# EAGLE design EvalBoard_MUXandTouchController_v0.2a (EAGLE 9.4.1)
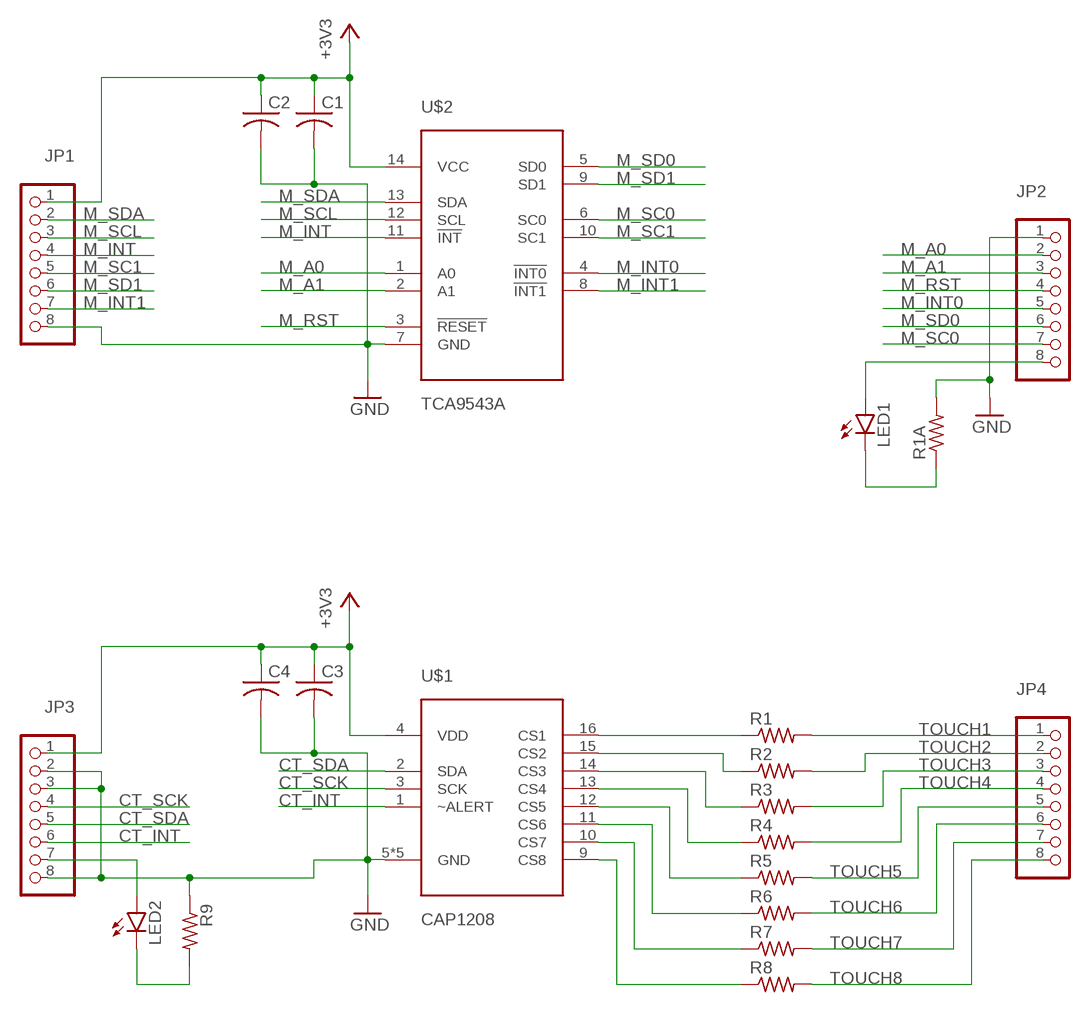
[diagram p0: schematic, sheet 1]

## Parts
C1  C-USC0603  [C0603]
C2  C-USC0603  [C0603]
C3  C-USC0603  [C0603]
C4  C-USC0603  [C0603]
JP1  PINHD-1X8BIG  [1X08-BIG]
JP2  PINHD-1X8BIG  [1X08-BIG]
JP3  PINHD-1X8BIG  [1X08-BIG]
JP4  PINHD-1X8BIG  [1X08-BIG]
LED1  LEDCHIP-LED0603  [CHIP-LED0603]
LED2  LEDCHIP-LED0603  [CHIP-LED0603]
R1  R-US_R0603  [R0603]
R1A  R-US_R0603  [R0603]
R2  R-US_R0603  [R0603]
R3  R-US_R0603  [R0603]
R4  R-US_R0603  [R0603]
R5  R-US_R0603  [R0603]
R6  R-US_R0603  [R0603]
R7  R-US_R0603  [R0603]
R8  R-US_R0603  [R0603]
R9  R-US_R0603  [R0603]
U$1  CAP1208  [QFN-16-3X3]
U$2  TCA9543A  [TSSOP-14]

## Nets
+3V3: C1.1 C2.1 C3.1 C4.1 JP1.1 JP3.1 U$1.4(VDD) U$2.14(VCC)
CT_INT: JP3.6 U$1.1(~ALERT)
CT_SCK: JP3.4 U$1.3(SCK)
CT_SDA: JP3.5 U$1.2(SDA)
GND: C1.2 C2.2 C3.2 C4.2 JP1.8 JP2.1 JP3.2 JP3.3 JP3.8 R1A.2 R9.1 U$1.5(GND) U$1.6(GND) U$1.7(GND) U$1.8(GND) U$1.PAD(GND) U$2.7(GND)
M_A0: JP2.2 U$2.1(A0)
M_A1: JP2.3 U$2.2(A1)
M_INT: JP1.4 U$2.11(!INT)
M_INT0: JP2.5 U$2.4(!INT0)
M_INT1: JP1.7 U$2.8(!INT1)
M_RST: JP2.4 U$2.3(!RESET)
M_SC0: JP2.7 U$2.6(SC0)
M_SC1: JP1.5 U$2.10(SC1)
M_SCL: JP1.3 U$2.12(SCL)
M_SD0: JP2.6 U$2.5(SD0)
M_SD1: JP1.6 U$2.9(SD1)
M_SDA: JP1.2 U$2.13(SDA)
N$1: R1.1 U$1.16(CS1)
N$2: JP3.7 LED2.A
N$3: R2.1 U$1.15(CS2)
N$4: LED2.C R9.2
N$5: JP2.8 LED1.A
N$6: LED1.C R1A.1
N$18: R3.1 U$1.14(CS3)
N$19: R4.1 U$1.13(CS4)
N$20: R5.1 U$1.12(CS5)
N$21: R6.1 U$1.11(CS6)
N$22: R7.1 U$1.10(CS7)
N$23: R8.1 U$1.9(CS8)
TOUCH1: JP4.1 R1.2
TOUCH2: JP4.2 R2.2
TOUCH3: JP4.3 R3.2
TOUCH4: JP4.4 R4.2
TOUCH5: JP4.5 R5.2
TOUCH6: JP4.6 R6.2
TOUCH7: JP4.7 R7.2
TOUCH8: JP4.8 R8.2

## Library data of the parts
C1-C4 = resistor:C-US: CAPACITOR, American symbol
JP1-JP4 = adafruit:PINHD-1X8: PIN HEADER
LED1 LED2 = led:LED: LED OSRAM: - CHIPLED LG R971, LG N971, LY N971, LG Q971, LY Q971, LO R971, LY R971 LH N974, LH R974 LS Q976, LO Q976, LY Q976 LO Q996 - Hyper CHIPLED LW Q18S LB Q993, LB Q99A, LB R99A - SideLED LS A670, LO A670, LY A670, LG A670, LP A670 LB A673, LV A673, LT A673, LW A673 LH A674 LY A675 LS A676, LA A676, LO A676, LY A676, LW A676 LS A679, LY A679, LG A679 - Hyper Micro SIDELED® LS Y876, LA Y876, LO Y876, LY Y876 LT Y87S - SmartLED LW L88C, LW L88S LB L89C, LB L89S, LG L890 LS L89K, LO L89K, LY L89K LS L896, LA L896, LO L896, LY L896 - TOPLED LS T670, LO T670, LY T670, LG T670, LP T670 LSG T670, LSP T670, LSY T670, LOP T670, LYG T670 LG T671, LOG T671, LSG T671 LB T673, LV T673, LT T673, LW T673 LH T674 LS T676, LA T676, LO T676, LY T676, LB T676, LH T676, LSB T676, LW T676 LB T67C, LV T67C, LT T67C, LS T67K, LO T67K, LY T67K, LW E67C LS E67B, LA E67B, LO E67B, LY E67B, LB E67C, LV E67C, LT E67C LW T67C LS T679, LY T679, LG T679 LS T770, LO T770, LY T770, LG T770, LP T770 LB T773, LV T773, LT T773, LW T773 LH T774 LS E675, LA E675, LY E675, LS T675 LS T776, LA T776, LO T776, LY T776, LB T776 LHGB T686 LT T68C, LB T68C - Hyper Mini TOPLED® LB M676 - Mini TOPLED Santana® LG M470 LS M47K, LO M47K, LY M47K Source: http://www.osram.convergy.de LUXEON: - LUMILED® LXK2-PW12-R00, LXK2-PW12-S00, LXK2-PW14-U00, LXK2-PW14-V00 LXK2-PM12-R00, LXK2-PM12-S00, LXK2-PM14-U00 LXK2-PE12-Q00, LXK2-PE12-R00, LXK2-PE12-S00, LXK2-PE14-T00, LXK2-PE14-U00 LXK2-PB12-K00, LXK2-PB12-L00, LXK2-PB12-M00, LXK2-PB14-N00, LXK2-PB14-P00, LXK2-PB14-Q00 LXK2-PR12-L00, LXK2-PR12-M00, LXK2-PR14-Q00, LXK2-PR14-R00 LXK2-PD12-Q00, LXK2-PD12-R00, LXK2-PD12-S00 LXK2-PH12-R00, LXK2-PH12-S00 LXK2-PL12-P00, LXK2-PL12-Q00, LXK2-PL12-R00 Source: www.luxeon.com KINGBRIGHT: KA-3528ASYC Source: www.kingbright.com
R1 R1A R2-R9 = resistor:R-US_: RESISTOR, American symbol
U$1 = MonthCalendar:CAP1208: Microchip - 8-Channel Capacitive Touch Sensor Controller - The CAP1208 is a multiple channel capacitive touch sensor controller. It contains eight (8) individual capacitive touch sensor inputs with programmable sensitivity for use in touch sensor applications. Each sensor input is calibrated to compensate for system parasitic capacitance and automatically recalibrated to compensate for gradual environmental changes. The CAP1208 includes Multiple Pattern Touch recognition that allows the user to select a specific set of buttons to be touched simultaneously. If this pattern is detected, a status bit is set and an interrupt is generated. The CAP1208 has Active and Standby states, each with its own sensor input configuration controls. Power consumption in the Standby state is dependent on the number of sensor inputs enabled as well as averaging, sampling time, and cycle time. Deep Sleep is the lowest power state available, drawing 5μA (typical) of current. In this state, no sensor inputs are active, and communications will wake the device.
U$2 = MonthCalendar:TCA9543A: TCA9543A Low Voltage 2-Channel I2C Bus Switch With Interrupt Logic And Reset

## Board
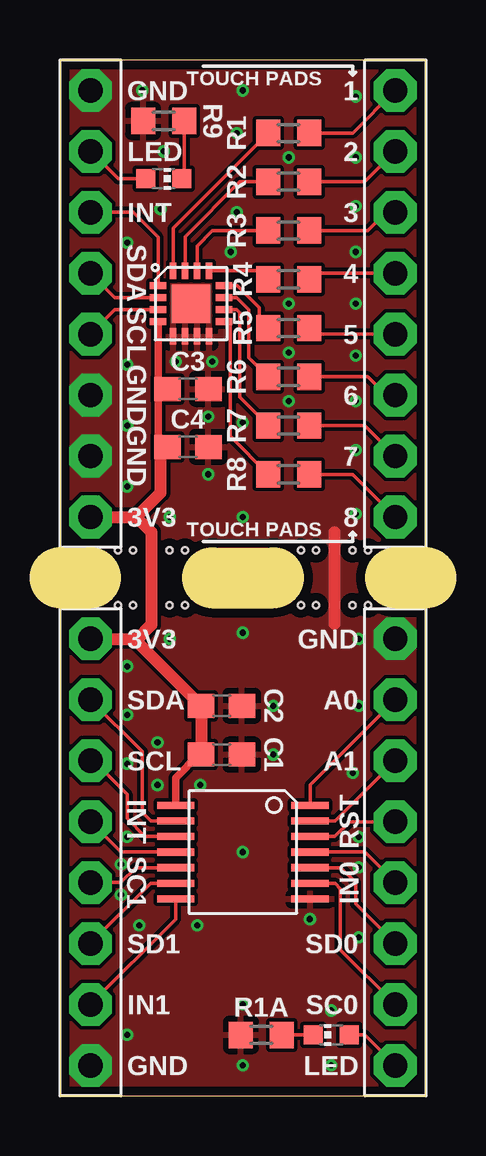
[diagram p1: board, top side]
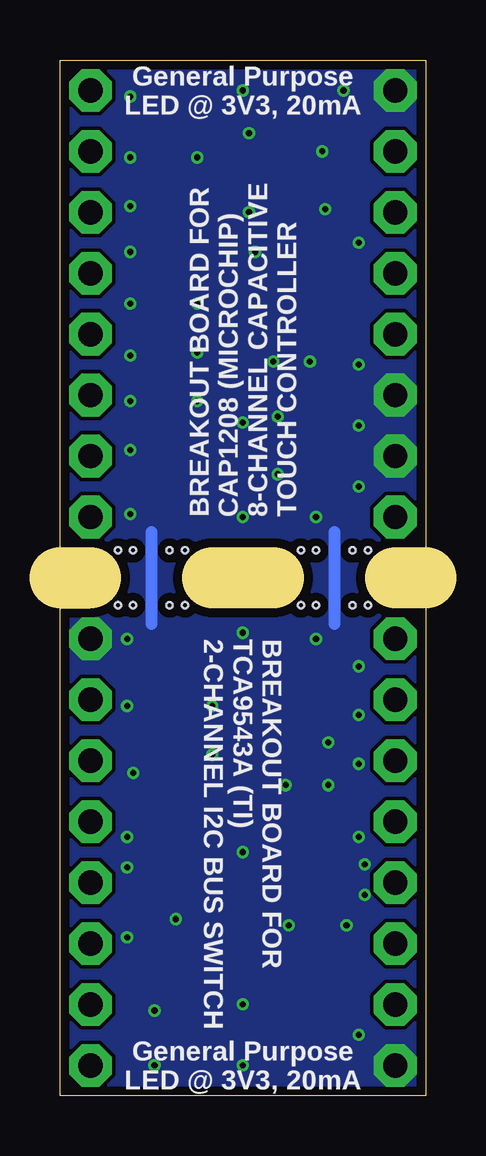
[diagram p2: board, bottom side, seen from below]

Size 15.24 x 43.18 mm. Coordinates in mm from the lower left corner, seen from the top.
Outline: 0,21.59 1.27,21.59
Outline: 6.35,21.59 8.89,21.59
Outline: 15.24,21.59 13.97,21.59
Outline: 0,0 15.24,0 15.24,43.18 0,43.18 0,0
Copper layers (1*16): Top 0.035559375mm / dielectric 1.6mm / Bottom 0.035559375mm
Design rules "oshpark-2layer-tented *": minimum track width 6mil, minimum drill 10mil, track to track 6mil, track to pad 6mil, pad to pad 6mil, via to via 6mil, smd to smd 6mil, copper to edge 15mil, drill to drill 6mil, minimum pad ring 5mil, minimum via ring 5mil, stop-mask expansion 2.5mil, vias tented up to drill 10mil, thermal gap 10mil
Holes 0.25 mm at 2.41,22.73 3.05,22.73 5.21,22.73 4.57,22.73 2.41,20.45 3.05,20.45 5.21,20.45 4.57,20.45 10.03,22.73 10.67,22.73 12.83,22.73 12.19,22.73 10.03,20.45 10.67,20.45 12.83,20.45 12.19,20.45
Milling: 3 lines

### Footprints (pad centres in the part's own frame; a part is rotated, then mirrored left to right if it is on the bottom)
C0603 = smd 1.1 x 1: 1 -0.85,0; 2 0.85,0
1X08-BIG = drill 1.016 pad 1.778 octagon: 1 -8.89,0; 2 -6.35,0; 3 -3.81,0; 4 -1.27,0; 5 1.27,0; 6 3.81,0; 7 6.35,0; 8 8.89,0
CHIP-LED0603 = smd 0.8 x 0.8: A 0,-0.75; C 0,0.75
R0603 = smd 1 x 1.1: 1 -0.85,0; 2 0.85,0
QFN-16-3X3 = smd 0.69 x 0.28: 1 -1.37,0.75; 2 -1.37,0.25; 3 -1.37,-0.25; 4 -1.37,-0.75; 9 1.37,-0.75; 10 1.37,-0.25; 11 1.37,0.25; 12 1.37,0.75 | smd 0.28 x 0.69: 5 -0.75,-1.37; 6 -0.25,-1.37; 7 0.25,-1.37; 8 0.75,-1.37; 13 0.75,1.37; 14 0.25,1.37; 15 -0.25,1.37; 16 -0.75,1.37 | smd 1.6 x 1.6: PAD 0,0
TSSOP-14 = smd 0.3 x 1.55: 1 -1.95,2.8; 2 -1.3,2.8; 3 -0.65,2.8; 4 0,2.8; 5 0.65,2.8; 6 1.3,2.8; 7 1.95,2.8; 8 1.95,-2.8; 9 1.3,-2.8; 10 0.65,-2.8; 11 0,-2.8; 12 -0.65,-2.8; 13 -1.3,-2.8; 14 -1.95,-2.8

### Placement (x,y rotation side)
C1  6.73,14.22 0 top
C2  6.73,16.26 0 top
C3  5.33,29.46 0 top
C4  5.33,27.05 0 top
JP1  1.27,10.16 270 top
JP2  13.97,10.16 270 top
JP3  1.27,33.02 90 top
JP4  13.97,33.02 270 top
LED1  11.3,2.54 90 top
LED2  4.32,38.23 270 top
R1  9.53,40.13 0 top
R1A  8.38,2.54 180 top
R2  9.53,38.1 0 top
R3  9.53,36.07 0 top
R4  9.53,34.04 0 top
R5  9.53,32 0 top
R6  9.53,29.97 0 top
R7  9.53,27.94 0 top
R8  9.53,25.91 0 top
R9  4.32,40.64 0 top
U$1  5.46,33.02 0 top
U$2  7.62,10.16 270 top

### Tracks (layer width: path | path; a pad name or v marks a point on that pad's centre or on a via)
+3V3
  Top 0.305: U$1.4 4.09,29.86 | 4.09,29.86 C3.1 | C1.1 5.79,14.22 4.82,13.25 U$2.14 | C4.1 4.19,27.05 4.09,27.15 4.09,29.86
  Top 0.508: JP3.1 3.17,24.13 | 3.17,24.13 3.81,23.5 3.81,19.64 3.22,19.05 3.09,19.05 | 3.17,24.13 4.19,25.15 4.19,27.05 | JP1.1 3.09,19.05 | C1.1 C2.1 3.09,19.05
CT_INT
  Top 0.152: U$1.1 4.09,35.79 3.05,36.83 JP3.6
CT_SCK
  Top 0.152: U$1.3 2.29,32.77 JP3.4
CT_SDA
  Top 0.152: U$1.2 2.29,33.27 JP3.5
GND  (via drill 0.25)
  Top 0.508: 11.43,23.5 11.43,19.68
  Bottom 0.508: 3.81,23.5 3.81,19.68 | 11.43,23.5 11.43,19.68
  other vias: 2.79,17.91 4.06,12.95 5.84,12.95 8.89,14.22 8.89,16.26 4.57,19.05 12.45,19.05 7.62,19.3 7.62,10.16 11.3,1.27 2.79,2.54 5.71,7.11 7.62,1.27 3.3,7.11 12.45,16.26 2.79,10.79 2.54,9.65 2.79,13.84 2.79,15.88 4.06,14.73 6.17,25.91 6.35,30.61 6.17,28.32 4.57,24.13 7.62,24.13 12.32,24.26 12.32,26.92 12.32,28.96 12.32,30.86 12.32,33.02 12.32,35.18 12.32,37.08 12.32,39.12 12.32,41.66 9.53,39.12 7.37,36.83 7.11,35.18 2.79,35.56 4.32,39.37 7.62,41.91 2.79,30.48 2.79,25.4 2.79,27.94 7.62,28.07 4.19,36.96 7.37,40.13 2.54,8.38 4.83,30.61 9.53,28.96 9.53,30.99 9.53,33.02 12.19,13.46 12.45,10.79 12.45,9.53 12.45,6.6 10.41,7.37 11.3,3.56 7.62,3.81 3.43,41.91
  pour Top: 0,43.18 0,0 15.24,0 15.24,43.18
  pour Bottom: 0,43.18 0,0 15.24,0 15.24,43.18
M_A0
  Top 0.152: U$2.1 10.42,12.96 JP2.2
M_A1
  Top 0.152: U$2.2 11.46,11.46 JP2.3
M_INT
  Top 0.152: U$2.11 2.54,10.16 JP1.4
M_INT0
  Top 0.152: JP2.5 12.7,10.16 U$2.4
M_INT1
  Top 0.152: JP1.7 4.82,7.36 U$2.8
M_RST
  Top 0.152: JP2.4 12.06,11.43 11.45,10.81 U$2.3
M_SC0
  Top 0.152: U$2.6 11.46,8.86 11.68,8.64 11.68,6.1 JP2.7
M_SC1
  Top 0.152: JP1.5 2.54,8.89 3.16,9.51 U$2.10
M_SCL
  Top 0.152: U$2.12 3.54,10.81 2.79,11.56 2.79,12.57 1.4,13.97 JP1.3
M_SD0
  Top 0.152: JP2.6 12.32,8 12.32,8.89 11.7,9.51 U$2.5
M_SD1
  Top 0.152: JP1.6 3.78,8.86 U$2.9
M_SDA
  Top 0.152: U$2.13 3.78,11.46 3.43,11.81 3.43,14.35 JP1.2
N$1
  Top 0.152: U$1.16 4.71,36.17 R1.1
N$2
  Top 0.152: JP3.7 1.28,39.37 2.42,38.23 LED2.A
N$3
  Top 0.152: U$1.15 5.21,35.82 7.49,38.1 R2.1
N$4
  Top 0.152: R9.2 5.17,38.23 LED2.C
N$5
  Top 0.152: JP2.8 12.7,2.54 LED1.A
N$6
  Top 0.152: LED1.C R1A.1
N$18
  Top 0.152: U$1.14 5.71,35.43 6.35,36.07 R3.1
N$19
  Top 0.152: U$1.13 8.32,34.39 R4.1
N$20
  Top 0.152: U$1.12 7.38,33.77 8.29,32.85 8.29,32.38 R5.1
N$21
  Top 0.152: U$1.11 7.37,33.27 7.87,32.77 7.87,30.77 R6.1
N$22
  Top 0.152: R7.1 7.49,29.12 7.49,32.64 7.36,32.77 U$1.10
N$23
  Top 0.152: R8.1 7.08,27.5 7.08,32.27 U$1.9
TOUCH1
  Top 0.152: JP4.1 12.19,40.13 R1.2
TOUCH2
  Top 0.152: R2.2 12.7,38.1 JP4.2
TOUCH3
  Top 0.152: JP4.3 13.59,36.83 12.83,36.07 R3.2
TOUCH4
  Top 0.152: JP4.4 10.63,34.29 R4.2
TOUCH5
  Top 0.152: JP4.5 10.63,31.75 R5.2
TOUCH6
  Top 0.152: JP4.6 13.59,29.21 12.83,29.97 R6.2
TOUCH7
  Top 0.152: JP4.7 12.7,27.94 R7.2
TOUCH8
  Top 0.152: JP4.8 12.19,25.91 R8.2

### Text on the board
bPlace: General Purpose / LED @ 3V3, 20mA | BREAKOUT BOARD FOR / CAP1208 (MICROCHIP) / 8-CHANNEL CAPACITIVE / TOUCH CONTROLLER | BREAKOUT BOARD FOR / TCA9543A (TI) / 2-CHANNEL I2C BUS SWITCH | General Purpose / LED @ 3V3, 20mA
tNames: GND | TOUCH PADS | 1 | LED | 2 | INT | 3 | SDA | 4 | SCL | 5 | GND | 6 | GND | 7 | 3V3 | TOUCH PADS | 8 | 3V3 | GND | SDA | A0 | SCL | A1 | INT | RST | SC1 | IN0 | SD1 | SD0 | IN1 | SC0 | GND | LED